# Altium schematic sheet solar_charger.SchDoc
size A4
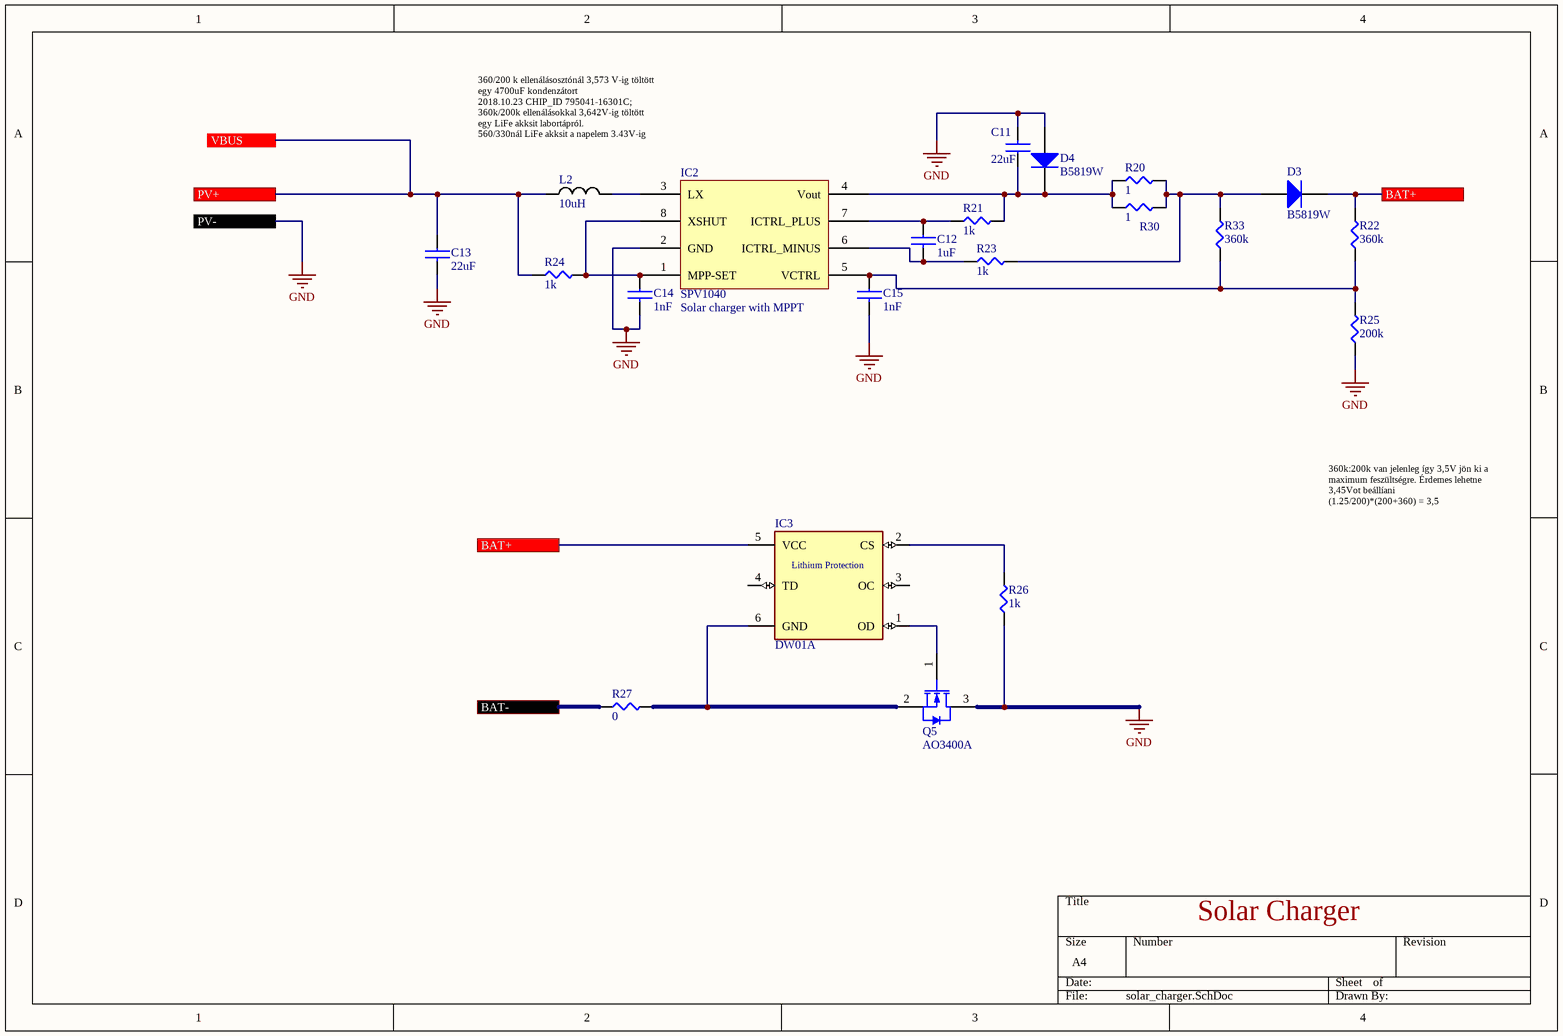
[diagram p0: solar_charger.SchDoc]

## Parts
C11  22uF  [CAPC200X125X110L50N]
C12  1uF  [CAPC200X125X110L50N]
C13  22uF  [CAPC200X125X110L50N]
C14  1nF  [CAPC160X80X90L35N]
C15  1nF  [CAPC160X80X90L35N]
D3  B5819W  [SODFL350X110-2N]
D4  B5819W  [SODFL350X110-2N]
IC2  SPV1040  [SPV1040]
IC3  DW01A  [CFP6P95_290X280X145L45X40N]
L2  10uH  [INDM730X660X300L160X290N]
Q5  AO3400A  [SOT23-3P95_240X114L20X40N]
R20  1  [RESC160X80X90L30N]
R21  1k  [RESC200X125X70L40N]
R22  360k  [RESC160X80X90L30N]
R23  1k  [RESC200X125X70L40N]
R24  1k  [RESC200X125X70L40N]
R25  200k  [RESC200X125X70L40N]
R26  1k  [RESC200X125X70L40N]
R27  0  [RESC200X125X70L40N]
R30  1  [RESC160X80X90L30N]
R33  360k  [RESC160X80X90L30N]

## Ports
BAT+, BAT-, PV+, PV-, VBUS

## Nets
GND: C11.2 C13.2 C14.2 C15.2 D4.A IC2.2(GND) Q5.3(DRAIN) R25.1 R26.1 ; port PV-
BAT+: D3.C IC3.5(VCC) R22.2 ; port BAT+
BAT-: R27.1 ; port BAT-
PV+: C13.1 L2.1 R24.1 ; port PV+, port VBUS
NetC11_1: C11.1 D4.C IC2.4(Vout) R20.1 R21.2 R30.1
NetC12_1: C12.1 IC2.7(ICTRL_PLUS) R21.1
NetC12_2: C12.2 IC2.6(ICTRL_MINUS) R23.1
NetC14_1: C14.1 IC2.1(MPP-SET) IC2.8(XSHUT) R24.2
NetC15_1: C15.1 IC2.5(VCTRL) R22.1 R25.2 R33.1
NetD3_A: D3.A R20.2 R23.2 R30.2 R33.2
NetIC2_3: IC2.3(LX) L2.2
NetIC3_1: IC3.1(OD) Q5.1(GATE)
NetIC3_2: IC3.2(CS) R26.2
NetIC3_6: IC3.6(GND) Q5.2(SOURCE) R27.2

Not connected (* = marked no-connect by the designer): IC3 3(OC) 4(TD)

## Notes on the sheet
- 360/200 k ellenálásosztónál 3,573 V-ig töltött egy 4700uF kondenzátort
  2018.10.23 CHIP_ID 795041-16301C; 360k/200k ellenálásokkal 3,642V-ig töltött egy LiFe akksit labortápról.
  560/330nál LiFe akksit a napelem 3.43V-ig töltött
- Solar charger with MPPT
- 360k:200k van jelenleg így 3,5V jön ki a maximum feszültségre. Érdemes lehetne 3,45Vot beállíani
  (1.25/200)*(200+360) = 3,5
- Solar Charger
- (in symbol DW01A) Lithium Protection

## Library data of the parts
C11-C15 = Capacitor: Part Number: *; Package: *
  C11 C13: Value: 22uF; LCSC Part #: C59461
  C12: Value: 1uF; LCSC Part #: C15849
  C14 C15: Value: 1nF; LCSC Part #: C1588
D3 D4 = Diode: Part Number: B5819W; LCSC Part #: C8598
IC3 = DW01A: Pushbutton Switch SPST-NC Standard Panel Mount, Front; MF: Fortune Semiconductor; Price: None; Availability: Unavailable; Package: Package Analog Devices; SnapEDA_Link: https://www.snapeda.com/parts/DW01A/Fortune%20Semiconductor/view-part/4388554/?ref=snap; MP: DW01A; Value: *; LCSC Part #: C61503
L2 = INDUCTOR: Alternatives: C139506; LCSC Part #: C132141; Value: 10uH
Q5 = N-FET: Alternatives: BSS806N, IRLML6244, IRLML6344; LCSC Part #: C20917; Part Number: AO3400A
R20-R26 R30 R33 = Resistor: Part Number: *; Package: *
  R20 R30: Value: 1; LCSC Part #: C22936
  R21 R23 R24 R26: Value: 1k; LCSC Part #: C17513
  R22: Value: 360k; LCSC Part #: C23146
  R25: Value: 200k; LCSC Part #: C17539
  R33: Value: 360k; LCSC Part #: not polluted
R27 = Resistor: This is a fuse!!!; Value: 0; Part Number: *; LCSC Part #: C17477; Package: *
IC2 = SPV1040: Part Number: SPV1040; LCSC Part #: C221500